# Altium schematic sheet LeBot.SchDoc
size A4
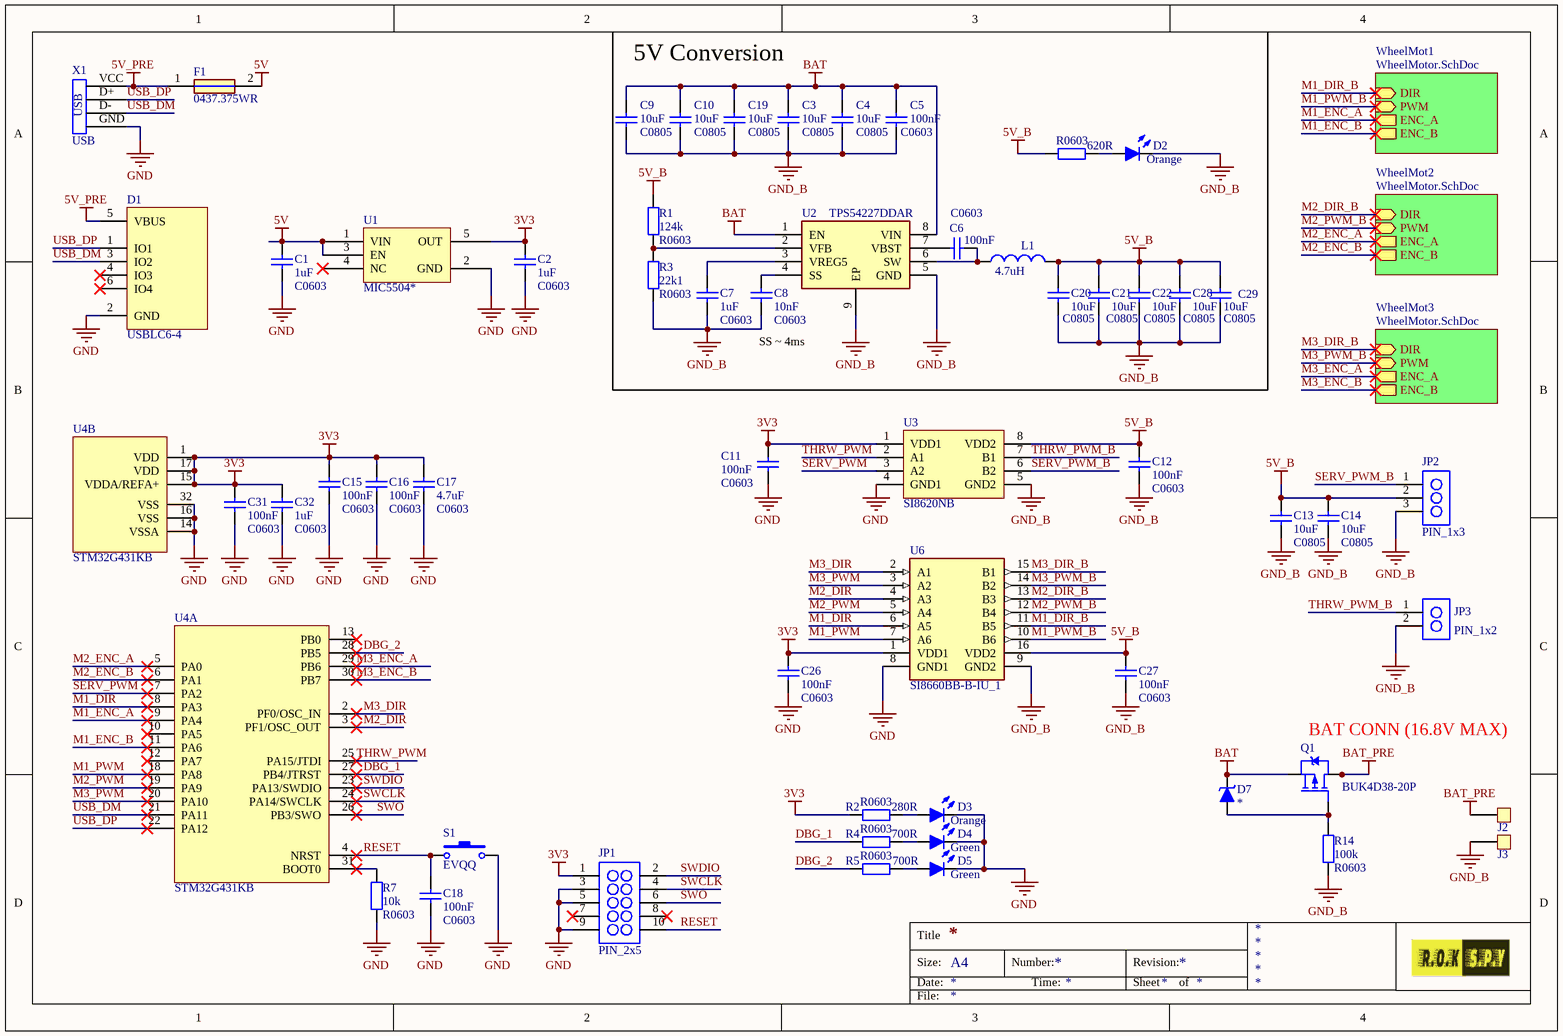
[diagram p0: LeBot.SchDoc]

## Parts
C1  Capacitance: 1uF  [C0603]
C2  Capacitance: 1uF  [C0603]
C3  Capacitance: 10uF  [C0805]
C4  Capacitance: 10uF  [C0805]
C5  Capacitance: 100nF  [C0603]
C6  Capacitance: 100nF  [C0603]
C7  Capacitance: 1uF  [C0603]
C8  Capacitance: 10nF  [C0603]
C9  Capacitance: 10uF  [C0805]
C10  Capacitance: 10uF  [C0805]
C11  Capacitance: 100nF  [C0603]
C12  Capacitance: 100nF  [C0603]
C13  Capacitance: 10uF  [C0805]
C14  Capacitance: 10uF  [C0805]
C15  Capacitance: 100nF  [C0603]
C16  Capacitance: 100nF  [C0603]
C17  Capacitance: 4.7uF  [C0603]
C18  Capacitance: 100nF  [C0603]
C19  Capacitance: 10uF  [C0805]
C20  Capacitance: 10uF  [C0805]
C21  Capacitance: 10uF  [C0805]
C22  Capacitance: 10uF  [C0805]
C26  Capacitance: 100nF  [C0603]
C27  Capacitance: 100nF  [C0603]
C28  Capacitance: 10uF  [C0805]
C29  Capacitance: 10uF  [C0805]
C31  Capacitance: 100nF  [C0603]
C32  Capacitance: 1uF  [C0603]
D1  USBLC6-4  [SOT-236]
D2  Colour: Orange  [LED_0805]
D3  Colour: Orange  [LED_0805]
D4  Colour: Green  [LED_0805]
D5  Colour: Green  [LED_0805]
D7  *  [SOT23-Zener]
F1  0437.375WR  [FUSC3216X86N]
J2  Connection_pad  [Wire_Pad]  (value not drawn)
J3  Connection_pad  [Wire_Pad]  (value not drawn)
JP1  PIN_2x5  [1.27_2X5H]
JP2  PIN_1x3  [1.27_1X3H]
JP3  PIN_1x2  [1.27_1X2H]
L1  Inductance: 4.7uH  [L73]  (hidden comment: Inductor)
Q1  BUK4D38-20P  [PMPB12EPX]
R1  124k  [R0603]
R2  280R  [R0603]
R3  22k1  [R0603]
R4  700R  [R0603]
R5  700R  [R0603]
R7  10k  [R0603]
R8  620R  [R0603]
R14  100k  [R0603]
S1  EVQQ  [EVQQ]
U1  MIC5504*  [SOT-235]
U2  TPS54227DDAR  [SOIC127P600X175-8N]
U3  SI8620NB  [SOIC127P600X175-8N]
U4  STM32G431KB  [QFP80P900X900X160-32N]  (parts A,B of 2)
U6  SI8660BB-B-IU_1  [SOP64P600X175-16N]
X1  USB  [USB MicroB Type 2.0]

## Sub-sheets
WheelMot1 = WheelMotor.SchDoc: PWM (in), ENC_A (out), DIR (in), ENC_B (out)
WheelMot2 = WheelMotor.SchDoc: PWM (in), ENC_A (out), DIR (in), ENC_B (out)
WheelMot3 = WheelMotor.SchDoc: PWM (in), ENC_A (out), DIR (in), ENC_B (out)

## Nets
3V3: C2.2 C11.2 C15.2 C16.2 C17.2 C26.2 C31.2 C32.2 JP1.1 R2.2 U1.5(OUT) U3.1(VDD1) U4.1(VDD) U4.15(VDDA/REFA+) U4.17(VDD) U6.1(VDD1)
5V: C1.2 F1.2 U1.1(VIN) U1.3(EN)
5V_B: C12.2 C13.2 C14.2 C20.2 C21.2 C22.2 C27.2 C28.2 C29.2 JP2.2 L1.2 R1.2 R8.2 U3.8(VDD2) U6.16(VDD2)
5V_PRE: D1.5(VBUS) F1.1 X1.VCC
BAT: C3.2 C4.2 C5.2 C9.2 C10.2 C19.2 D7.2(K) Q1.1(S) U2.1(EN) U2.8(VIN)
BAT_PRE: J2.1 Q1.3(D) Q1.D0(D) Q1.D1(D) Q1.D2(D)
GND: C1.1 C2.1 C11.1 C15.1 C16.1 C17.1 C18.1 C26.1 C31.1 C32.1 D1.2(GND) D3.2(K) D4.2(K) D5.2(K) JP1.3 JP1.5 JP1.9 R7.1 S1.2 U1.2(GND) U3.4(GND1) U4.14(VSSA) U4.16(VSS) U4.32(VSS) U6.8(GND1) X1.GND
GND_B: C3.1 C4.1 C5.1 C7.1 C8.1 C9.1 C10.1 C12.1 C13.1 C14.1 C19.1 C20.1 C21.1 C22.1 C27.1 C28.1 C29.1 D2.2(K) J3.1 JP2.3 JP3.2 R3.1 R14.2 U2.5(GND) U2.9(EP) U3.5(GND2) U6.9(GND2)
DBG_1: R4.2 U4.27(PB4/JTRST)
DBG_2: R5.2 U4.28(PB5)
M1_DIR: U4.8(PA3) U6.6(A5)
M1_DIR_B: U6.11(B5) ; sheet WheelMot1/DIR
M1_ENC_A: U4.9(PA4) ; sheet WheelMot1/ENC_A
M1_ENC_B: U4.11(PA6) ; sheet WheelMot1/ENC_B
M1_PWM: U4.18(PA8) U6.7(A6)
M1_PWM_B: U6.10(B6) ; sheet WheelMot1/PWM
M2_DIR: U4.3(PF1/OSC_OUT) U6.4(A3)
M2_DIR_B: U6.13(B3) ; sheet WheelMot2/DIR
M2_ENC_A: U4.5(PA0) ; sheet WheelMot2/ENC_A
M2_ENC_B: U4.6(PA1) ; sheet WheelMot2/ENC_B
M2_PWM: U4.19(PA9) U6.5(A4)
M2_PWM_B: U6.12(B4) ; sheet WheelMot2/PWM
M3_DIR: U4.2(PF0/OSC_IN) U6.2(A1)
M3_DIR_B: U6.15(B1) ; sheet WheelMot3/DIR
M3_ENC_A: U4.29(PB6) ; sheet WheelMot3/ENC_A
M3_ENC_B: U4.30(PB7) ; sheet WheelMot3/ENC_B
M3_PWM: U4.20(PA10) U6.3(A2)
M3_PWM_B: U6.14(B2) ; sheet WheelMot3/PWM
RESET: C18.2 JP1.10 S1.1 U4.4(NRST)
SERV_PWM: U3.3(A2) U4.7(PA2)
SERV_PWM_B: JP2.1 U3.6(B2)
SWCLK: JP1.4 U4.24(PA14/SWCLK)
SWDIO: JP1.2 U4.23(PA13/SWDIO)
SWO: JP1.6 U4.26(PB3/SWO)
THRW_PWM: U3.2(A1) U4.25(PA15/JTDI)
THRW_PWM_B: JP3.1 U3.7(B1)
USB_DM: D1.3(IO2) U4.21(PA11) X1.D-
USB_DP: D1.1(IO1) U4.22(PA12) X1.D+
NetC6_1: C6.1 L1.1 U2.6(SW)
NetC6_2: C6.2 U2.7(VBST)
NetC7_2: C7.2 U2.3(VREG5)
NetC8_2: C8.2 U2.4(SS)
NetD2_1: D2.1(A) R8.1
NetD3_1: D3.1(A) R2.1
NetD4_1: D4.1(A) R4.1
NetD5_1: D5.1(A) R5.1
NetD7_1: D7.1(A) Q1.2(G) R14.1
NetR1_1: R1.1 R3.2 U2.2(VFB)
NetR7_2: R7.2 U4.31(BOOT0)

Not connected (* = marked no-connect by the designer): D1 4(IO3)* 6(IO4)*; JP1 7* 8*; U1 4(NC)*; U4 10(PA5)* 12(PA7)* 13(PB0)*

## Notes on the sheet
- 5V Conversion
- SS ~ 4ms
- (near Q1) BAT CONN (16.8V MAX)
- Title
- Size:
- Date:
- A4
- Number:
- Time:
- Revision:
- Sheet
- of
- File:

## Library data of the parts
C1-C22 C26-C29 C31 C32 = Capacitor: Ceramic capacitor; Type: MLCC; Voltage rating: *V; ComponentLinknDescription: Datasheet; Characteristic: *; Manufacturer: *; ComponentLinknURL: *
  C1 C2 C5-C8 C11 C12 C15-C18 C26 C27 C31 C32: Note: C0603
  C3 C4 C9 C10 C13 C14 C19-C22 C28 C29: Note: C0805
D1 = USBLC6-4: USB ESD Protection; Manufacturer: ST Microelectronics; ComponentLinknDescription: Datasheet; Space heritage: false; Verified: false; Part number: USBLC6-4
D2 D3 = LED: Light Emitting Diode; Part number: MC011368; ComponentLinknDescription: Datasheet; Forward Voltage: 2.1V; Space heritage: false; Forward Current: 20mA; Power dissipation: false; Farnell Order Nr: 3015159
D4 D5 = LED: Light Emitting Diode; Part number: KP-2012LSGC; ComponentLinknDescription: Datasheet; Forward Voltage: 1.9V; Space heritage: false; Forward Current: 2mA; Power dissipation: false; Farnell Order Nr: 2463991
D7 = Zener Diode: PartNumber: *; Parameter 3: *; Parameter 4: *; Farnell Order Nr: *; Zener Voltage: *; Parameter 2: *
F1 = 0437.375WR: Fuse; Manufacturer_Name: LITTELFUSE; Datasheet Link: https://ms.componentsearchengine.com/Datasheets/2/0437.375WR.pdf; Height: 0.864mm; Manufacturer_Part_Number: 0437.375WR
L1 = Inductor: Saturation current: *A; DC resistance: *R; Self resonant frequency: *Hz; ComponentLinknDescription: Datasheet; Core material: *; RMS current: *A; Construction: *; ComponentLinknURL: *; Manufacturer: *; Note: =Inductance + " " + CurrentFootprint
Q1 = P-Channel MOSFET: GS breakdown Volt: 12V/-12V; DS Breakdown Volt: -20V; Drain Current: -18A; rDSon: 30mOhm; PartNumber: BUK4D38-20P; Farnell Order Nr: 3526152; Mouser Order Nr: 771-BUK4D38-20PX; Datasheet: https://eu.mouser.com/datasheet/2/916/BUK4D38-20P-1880069.pdf; Parameter 1: *
R1-R5 R7 R8 R14 = Resistor: Precision: *%; Voltage rating: *V; Temp coefficient: *ppm; Power rating: *mW; ComponentLinknDescription: Datasheet; Manufacturer: *; ComponentLinknURL: *; Note: R0603
  R1: Resistance: 124k
  R2: Resistance: 280R
  R3: Resistance: 22k1
  R4 R5: Resistance: 700R
  R7: Resistance: 10k
  R8: Resistance: 620R
  R14: Resistance: 100k
S1 = EVQQ: Switch; Manufacturer: Panasonic; ComponentLinknDescription: Datasheet; Space heritage: false; Drawn by: Erik Ilbis; Verified: false; Part number: EVQQ
U1 = MIC5504: Low-dropout voltage regulator; Manufacturer: Microchip/Micrel; Space heritage: false; Current Rating: 300 mA; Input Voltage: 2V5 to 5V5; Accuracy: 2%; Part number: MIC5504; Verified: false; Drawn by: Roberts Oskars Komarovskis; ComponentLink1Description: Datasheet; ComponentLink1URL: https://www.mouser.ee/datasheet/2/268/MIC550X-1082389.pdf; Package Type: *
U2 = TPS54227DDAR: 4.5-V to 18-V Input, 2-A SynchronousStep-DownConverter; Manufacturer_Name: Texas Instruments; Datasheet Link: http://www.ti.com/lit/gpn/tps54227; Height: 1.7mm; Manufacturer_Part_Number: TPS54227DDAR; PartNumber: TPS54227DDAR; Farnell Order Nr: 3007320
U3 = SI8620BB-B-IS: Digital Isolator, 2 Channel, 8 ns, 2.5 V, 5.5 V, NSOIC, 8 Pins; Manufacturer: Silicon Labs; PartNumber: SI86; Str1: NB; ComponentLink1Description: Datasheet; ComponentLink1URL: http://www.farnell.com/datasheets/2244974.pdf?_ga=2.133957773.2069242502.1604233078-1290644116.1596735146&_gac=1.216125090.1601500870.EAIaIQobChMI2YybtueR7AIVis_tCh0ENQp0EAAYASAAEgKKifD_BwE; Datasheet: http://www.farnell.com/datasheets/2244974.pdf?_ga=2.133957773.2069242502.1604233078-1290644116.1596735146&_gac=1.216125090.1601500870.EAIaIQobChMI2YybtueR7AIVis_tCh0ENQp0EAAYASAAEgKKifD_BwE; Drawn By: Roberts Oskars Komarovskis; PackageType: 20
U4 = STM32G431KB: ARM MCU, STM32 Family STM32G4 Series Microcontrollers, ARM Cortex-M4F, 32bit, 170 MHz, 64 KB, 32 KB; Manufacturer: STMicroelectronics; ComponentLink1Description: Datasheet; ComponentLink1URL: 3515807; Drawn By: Roberts Oskars Komarovskis; Farnell Order Nr: 3515807; Datasheet: https://eu.mouser.com/datasheet/2/389/stm32g431c6-1600866.pdf
U6 = SI8660: Low Power Six-Channel Digital Isolator; Manufacturer_Name: Silicon Labs; Manufacturer_Part_Number: SI8661BB-B-IU; Datasheet Link: https://componentsearchengine.com//SI8661BB-B-IU.pdf; Height: 1.75mm; Mouser2 Part Number: 634-SI8661BB-B-IU; Mouser2 Price/Stock: https://www.mouser.com/Search/Refine.aspx?Keyword=634-SI8661BB-B-IU; ComponentLink1Description: Datasheet; ComponentLink1URL: https://4donline.ihs.com/images/VipMasterIC/IC/SILC/SILC-S-A0009375737/SILC-S-A0009375737-1.pdf?hkey=6D3A4C79FDBF58556ACFDE234799DDF0; Farnell Order Nr: 2423337; PartNumber: SI8660BB-B-IU_1
JP1 = PIN_2x5: Manufacturer: *; Part Number: *; ComponentLinknDescription: *; ComponentLinknURL: *; Drawn By: Erik Ilbis
JP2 = PIN_1x3: Manufacturer: *; Part Number: *; ComponentLinknDescription: *; ComponentLinknURL: *; Drawn By: Erik Ilbis
JP3 = PIN_1x2: Manufacturer: *; Part Number: *; ComponentLinknURL: *; Drawn By: Erik Ilbis; ComponentLinknDescription: *